# Altium project Bahram_Project.PrjPcb
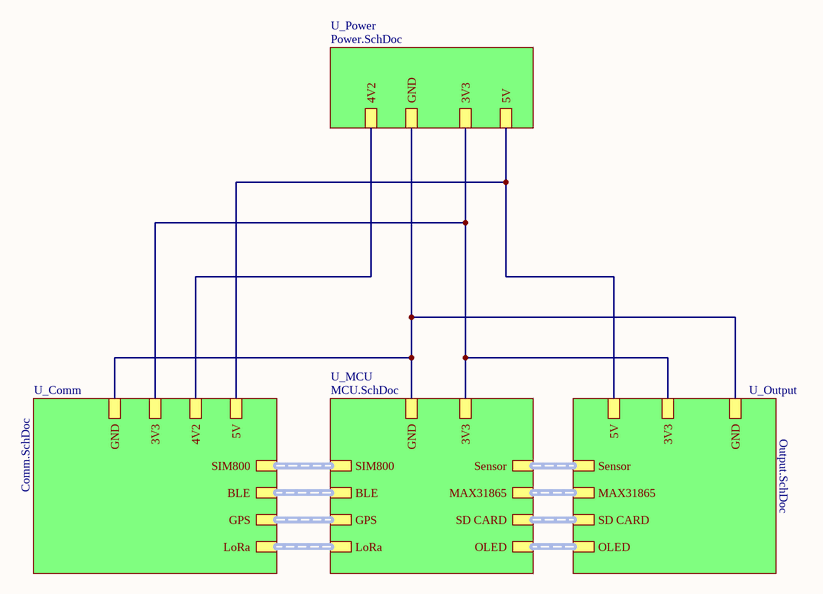
[diagram p0: main.SchDoc]
4 sheets, 72 parts. Net scope: strictly hierarchical (ports join the sheet entries above them; power ports are local).
Board file: Bahran_pcb.PcbDoc
Sheets:
  main.SchDoc
    U_Comm = Comm.SchDoc
    U_MCU = MCU.SchDoc
    U_Output = Output.SchDoc

## Sheet main.SchDoc
size A; SheetNumber: 1; SheetTotal: 5

### Sub-sheets
U_Comm = Comm.SchDoc: SIM800 (harness SIM800), BLE (harness BLE), GPS (harness GPS), LoRa (harness LORA), 5V, 4V2, 3V3, GND
U_MCU = MCU.SchDoc: SIM800 (harness SIM800), BLE (harness BLE), GPS (harness GPS), LoRa (harness LORA), Sensor (harness Sensor), MAX31865 (harness MAX31865), SD CARD (harness SD CARD), OLED (harness OLED), 3V3, GND
U_Output = Output.SchDoc: Sensor (harness Sensor), MAX31865 (harness MAX31865), SD CARD (harness SD CARD), OLED (harness OLED), 5V, 3V3, GND
U_Power = Power.SchDoc (file not in this document): 5V, 4V2, 3V3, GND

### Nets
3V3: sheet U_Comm/3V3, sheet U_MCU/3V3, sheet U_Output/3V3, sheet U_Power/3V3
4V2: sheet U_Comm/4V2, sheet U_Power/4V2
5_SW: sheet U_Comm/5V, sheet U_Output/5V, sheet U_Power/5V
GND: sheet U_Comm/GND, sheet U_MCU/GND, sheet U_Output/GND, sheet U_Power/GND

### Buses and harness runs
harness sheet U_Comm/BLE = sheet U_MCU/BLE
harness sheet U_Comm/GPS = sheet U_MCU/GPS
harness sheet U_Comm/LoRa = sheet U_MCU/LoRa
harness sheet U_Comm/SIM800 = sheet U_MCU/SIM800
harness sheet U_MCU/MAX31865 = sheet U_Output/MAX31865
harness sheet U_MCU/OLED = sheet U_Output/OLED
harness sheet U_MCU/SD CARD = sheet U_Output/SD CARD
harness sheet U_MCU/Sensor = sheet U_Output/Sensor

## Sheet Comm.SchDoc
size Legal; SheetNumber: 5; SheetTotal: 5
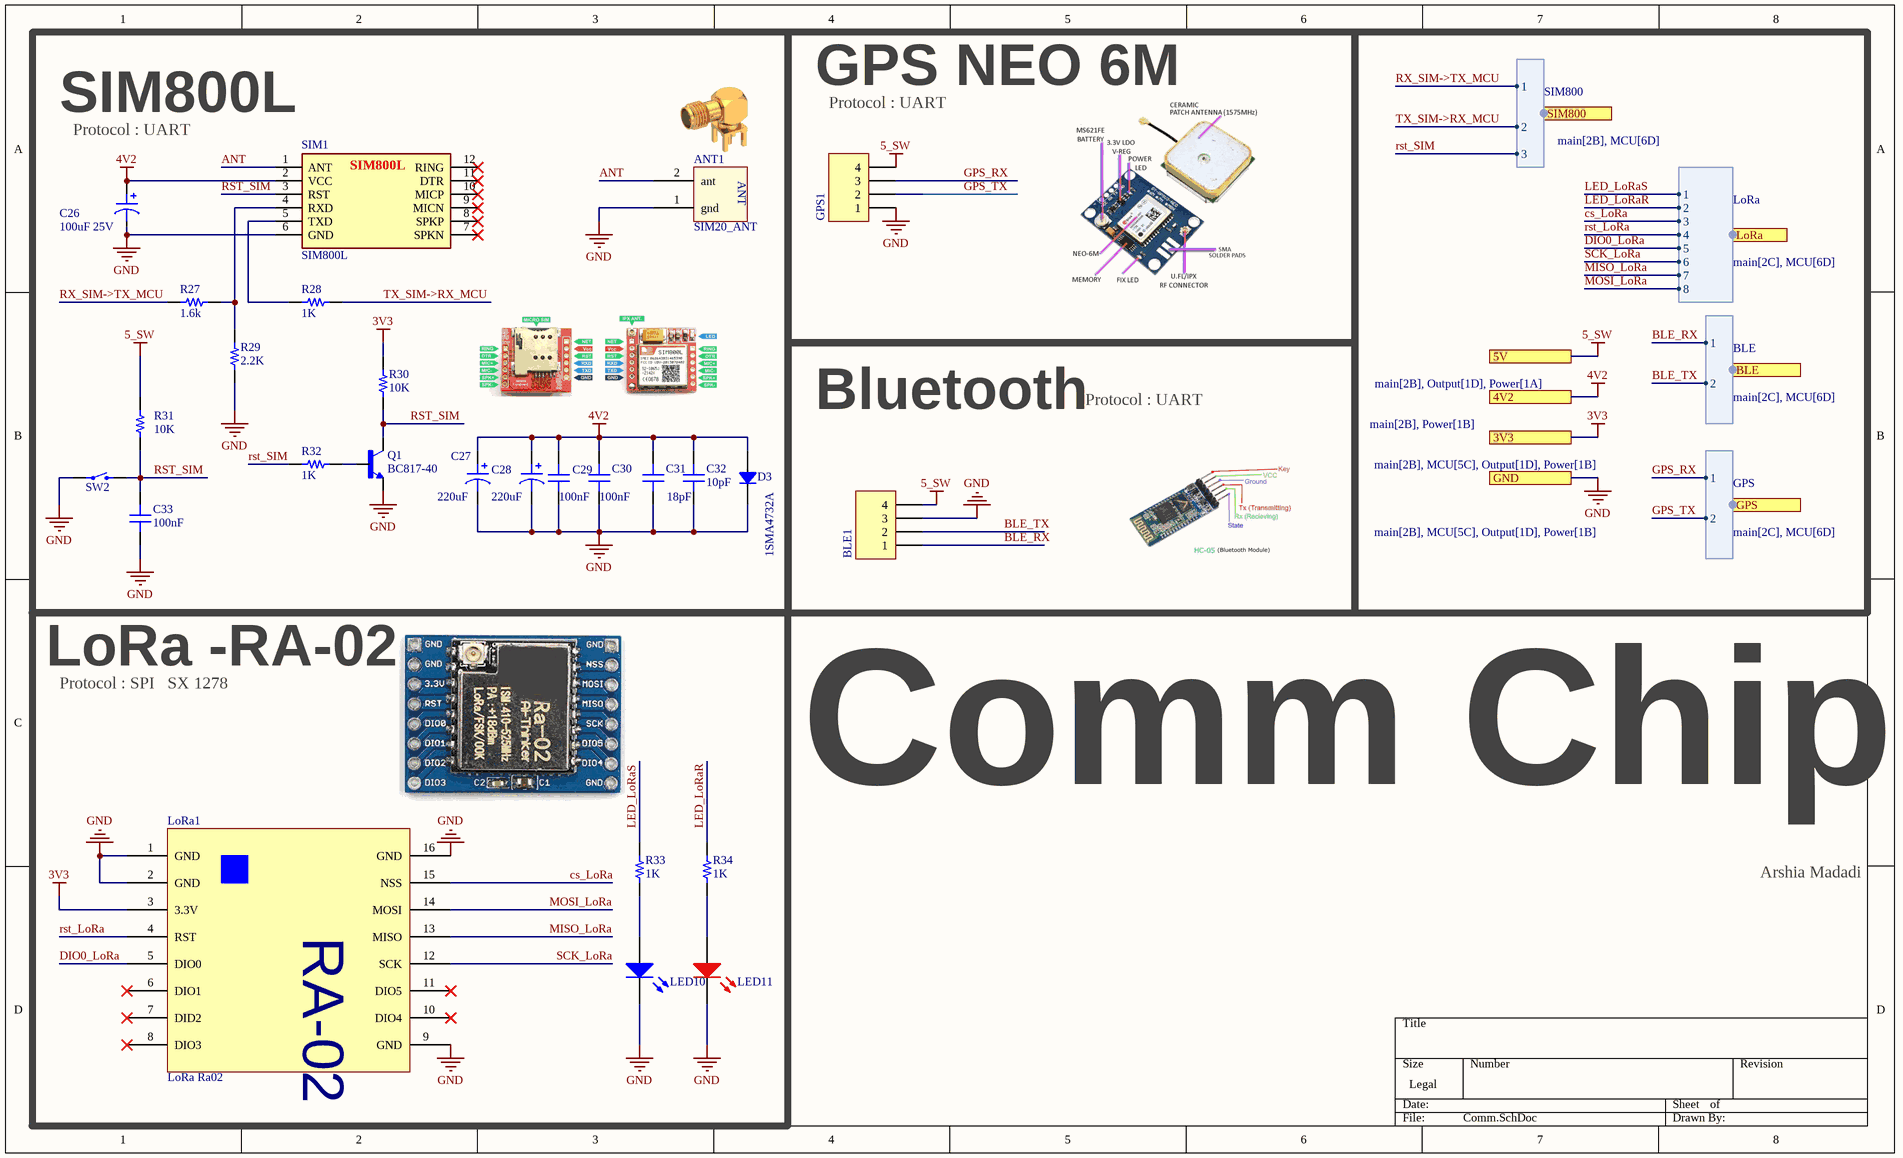
[diagram p1: Comm.SchDoc]

### Parts
ANT1  SIM20_ANT  [MY_SIM20_ANT]
BLE1  Header 4  [My_1X04]  (value not drawn)
C26  100uF 25V  [CAP ALSMD POLY 10.3MM H10.5MM]
C27  220uF  [CAP TANSMD 2312_6032 CASE C]
C28  220uF  [CAP TANSMD 2312_6032 CASE C]
C29  100nF  [CAP 0603_1608]
C30  100nF  [CAP 0603_1608]
C31  18pF  [CAP 0603_1608]
C32  10pF  [CAP 0603_1608]
C33  100nF  [CAP 0603_1608]
D3  1SMA4732A  [DO-214AC SMA]
GPS1  Header 4  [My_1X04]  (value not drawn)
LED10  LED SMD 0805 BLUE  [LED_0805_RED]  (value not drawn)
LED11  LED SMD 0805 RED  [LED_0805_RED]  (value not drawn)
LoRa1  LoRa Ra02  [LoRa - Ra-02]
Q1  BC817-40  [SOT95P237X112-3N]
R27  1.6k  [RES 0603_1608]
R28  1K  [RES 0603_1608]
R29  2.2K  [RES 0603_1608]
R30  10K  [RES 0603_1608]
R31  10K  [RES 0603_1608]
R32  1K  [RES 0603_1608]
R33  1K  [RES 0603_1608]
R34  1K  [RES 0603_1608]
SIM1  SIM800L  [SIM800L]
SW2  Tactile 2PIN 6X3.5mm H4.57mm (SMD)  [SWPBS_SPST_6X3X5]  (value not drawn)

### Blocks framed on the sheet
SIM800L: ANT1 C26-C33 D3 Q1 R27-R32 SIM1 SW2
GPS NEO 6M: GPS1
Bluetooth: BLE1
LoRa -RA-02: LED10 LED11 LoRa1 R33 R34

### Ports
3V3 (see main[2B], MCU[5C], Output[1D], Power[1B]), 4V2 (see main[2B], Power[1B]), 5V (see main[2B], Output[1D], Power[1A]), BLE (harness BLE, see main[2C], MCU[6D]), GND (see main[2B], MCU[5C], Output[1D], Power[1B]), GPS (harness GPS, see main[2C], MCU[6D]), LoRa (harness LORA, see main[2C], MCU[6D]), SIM800 (harness SIM800, see main[2B], MCU[6D])

### Harnesses
LoRa: 1, 2, 3, 4, 5, 6, 7, 8
BLE: 1, 2
GPS: 1, 2
SIM800: 1, 2, 3

### Nets
3V3: LoRa1.3(3.3V) R30.1 ; port 3V3
4V2: C26.1 C27.1 C28.1 C29.2 C30.2 C31.2 C32.2 D3.1 SIM1.2(VCC) ; port 4V2
5_SW: BLE1.4 GPS1.4 R31.2 ; port 5V
GND: ANT1.1(gnd) BLE1.3 C26.2 C27.2 C28.2 C29.1 C30.1 C31.1 C32.1 C33.1 D3.2 GPS1.1 LED10.2(K) LED11.2(K) LoRa1.1(GND) LoRa1.2(GND) LoRa1.9(GND) LoRa1.16(GND) Q1.2(E) R29.2 SIM1.6(GND) SW2.1 ; port GND
ANT: ANT1.2(ant) SIM1.1(ANT)
BLE_RX: BLE1.1 ; port BLE.1
BLE_TX: BLE1.2 ; port BLE.2
cs_LoRa: LoRa1.15(NSS) ; port LoRa.3
DIO0_LoRa: LoRa1.5(DIO0) ; port LoRa.5
GPS_RX: GPS1.3 ; port GPS.1
GPS_TX: GPS1.2 ; port GPS.2
LED_LoRaR: R34.1 ; port LoRa.2
LED_LoRaS: R33.1 ; port LoRa.1
MISO_LoRa: LoRa1.13(MISO) ; port LoRa.7
MOSI_LoRa: LoRa1.14(MOSI) ; port LoRa.8
rst_LoRa: LoRa1.4(RST) ; port LoRa.4
RST_SIM: C33.2 Q1.3(C) R30.2 R31.1 R32.2 SIM1.3(RST) SW2.2 ; port SIM800.3
RX_SIM->TX_MCU: R27.1 ; port SIM800.1
SCK_LoRa: LoRa1.12(SCK) ; port LoRa.6
TX_SIM->RX_MCU: R28.1 ; port SIM800.2
NetLED10_1: LED10.1(A) R33.2
NetLED11_1: LED11.1(A) R34.2
NetQ1_1: Q1.1(B) R32.1
NetR27_2: R27.2 R29.1 SIM1.4(RXD)
NetR28_2: R28.2 SIM1.5(TXD)

Not connected (* = marked no-connect by the designer): LoRa1 6(DIO1)* 7(DID2)* 8(DIO3)* 10(DIO4)* 11(DIO5)*; SIM1 7(SPKN)* 8(SPKP)* 9(MICN)* 10(MICP)* 11(DTR)* 12(RING)*

### Notes on the sheet
- Protocol : UART
- Protocol : SPI
- SX 1278
- Comm Chip
- Arshia Madadi
- (in symbol LoRa) RA-02

### Library data of the parts
ANT1 = SIM20_ANT: ANT
BLE1 GPS1 = Header 4: Header, 4-Pin; LatestRevisionDate: 17-Jul-2002; LatestRevisionNote: Re-released for DXP Platform.; Publisher: Altium Limited
C26 = Cap Alu SMD 10.3mm H10.5mm: SMT Aluminum Polymer Capacitor; VALUE: 10uF 6.3V
C27 C28 = Cap Tan Case C: SMT Tantalum Capacitor; VALUE: 10uF 6.3V
C29 C30 C33 = Cap 0603: SMT Capacitor; VALUE: 100nF
C31 C32 = Cap 0603: SMT Capacitor; VALUE: 100nF
D3 = US1M (SMD SMA): Diode Standard 1000V 1A Surface Mount SMA; PartNumber: US1M-13-F
LoRa1 = LoRa
Q1 = BC817-40_RFG: SOT-23, 50V, 0.5A, NPN Bipolar Transistor; MP: BC817-40 RFG; MF: Taiwan Semiconductor; Check_prices: https://www.snapeda.com/parts/BC817-40%20RFG/Taiwan+Semiconductor/view-part/?ref=eda; Price: None; Purchase-URL: https://pricing.snapeda.com/search/part/BC817-40 RFG/?ref=eda; SnapEDA_Link: https://www.snapeda.com/parts/BC817-40%20RFG/Taiwan+Semiconductor/view-part/?ref=snap; Availability: In Stock; Package: SOT-23 Taiwan Semiconductor; Value: *; ComponentLink1Description: Buy; ComponentLink1URL: https://lionelectronic.ir/products/134-BC817-40
R27-R34 = Res 0603: SMT Resistor; VALUE: 100K
SW2 = Tactile 2PIN 6X3.5mm H4.57mm (SMD): Tactile Switch SPST-NO Top Actuated Surface Mount; PartNumber: FSMSMTR-ND
SIM1 = SIM800L: Publisher: 3DFootprint.ir

## Sheet MCU.SchDoc
size Tabloid; SheetNumber: 3; SheetTotal: 5
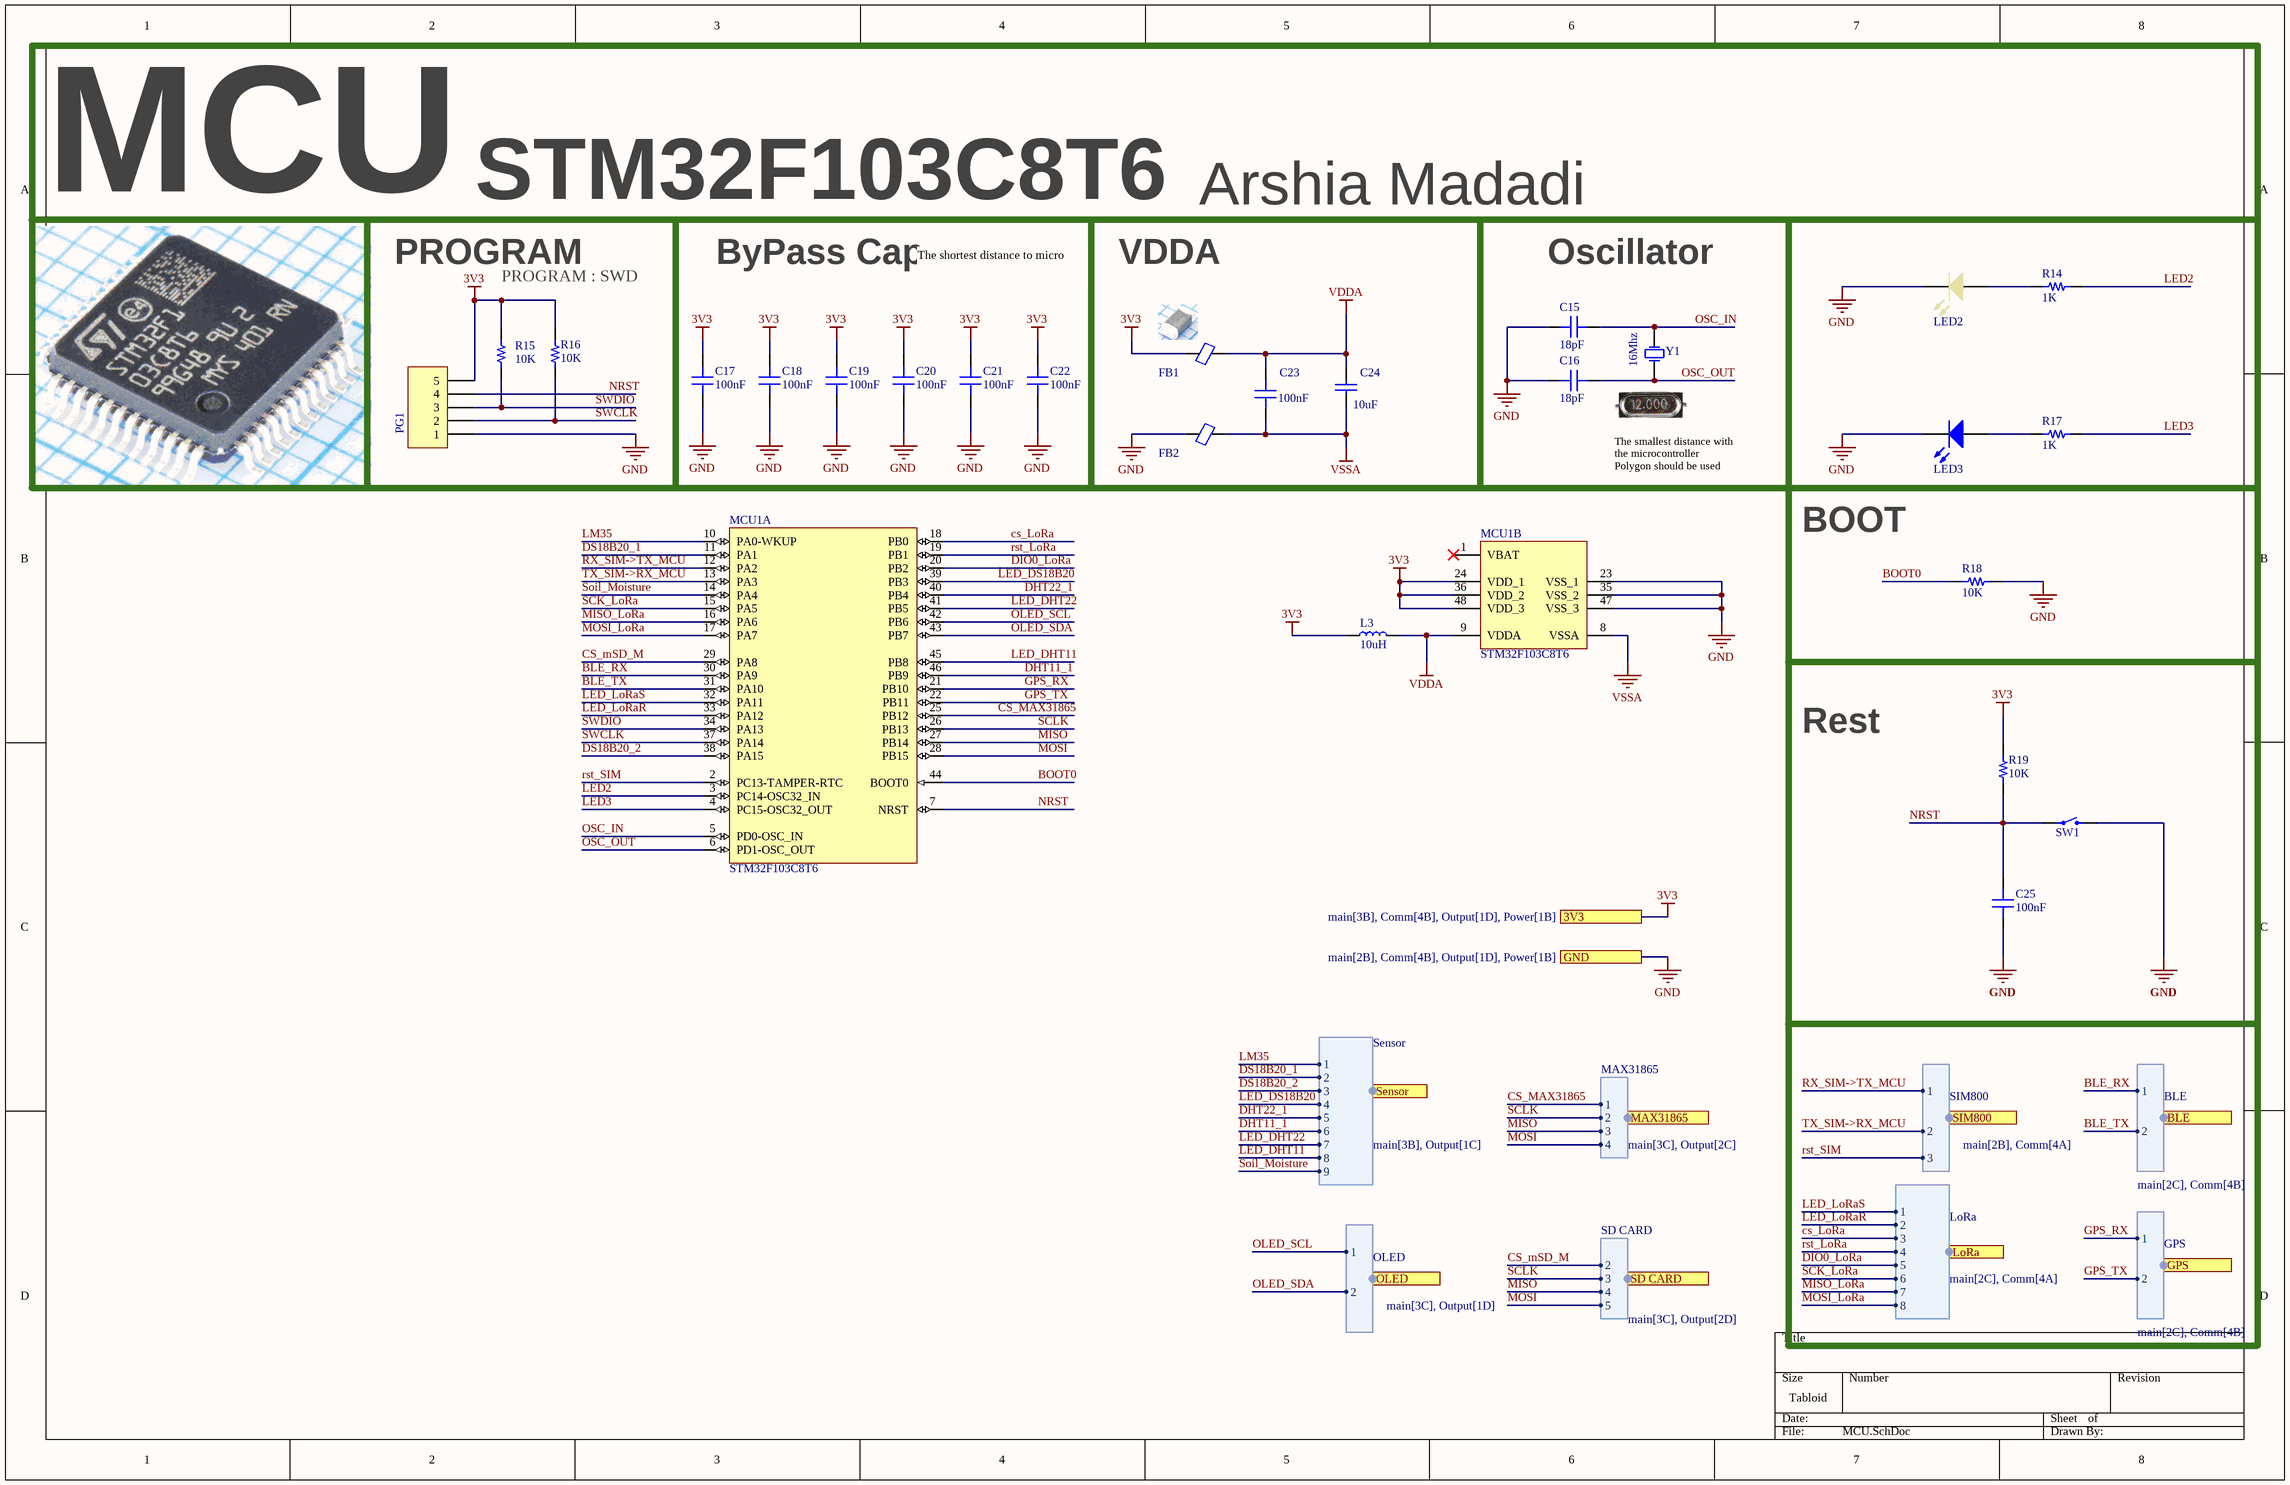
[diagram p2: MCU.SchDoc]

### Parts
C15  18pF  [CAP 0603_1608]
C16  18pF  [CAP 0603_1608]
C17  100nF  [CAP 0603_1608]
C18  100nF  [CAP 0603_1608]
C19  100nF  [CAP 0603_1608]
C20  100nF  [CAP 0603_1608]
C21  100nF  [CAP 0603_1608]
C22  100nF  [CAP 0603_1608]
C23  100nF  [CAP 0603_1608]
C24  10uF  [MY_CAP_SMD_0603]
C25  100nF  [CAP 0603_1608]
FB1  Ferrite Bead SMD  [FB1206]  (value not drawn)
FB2  Ferrite Bead SMD  [FB1206]  (value not drawn)
L3  10uH  [IND 1206_3216]
LED2  LED SMD 0805 WHITE  [LED_0805_WHITE]  (value not drawn)
LED3  LED SMD 0805 BLUE  [LED_0805_RED]  (value not drawn)
MCU1  STM32F103C8T6  [QFP50P900X900X160-48N]  (parts A,B of 2)
PG1  Header 5  [My_1X05]  (value not drawn)
R14  1K  [RES 0603_1608]
R15  10K  [RES 0603_1608]
R16  10K  [RES 0603_1608]
R17  1K  [RES 0603_1608]
R18  10K  [RES 0603_1608]
R19  10K  [RES 0603_1608]
SW1  Tactile 2PIN 6X3.5mm H4.57mm (SMD)  [SWPBS_SPST_6X3X5]  (value not drawn)
Y1  16Mhz  [Crystal]

### Blocks framed on the sheet
MCU: C15-C24 FB1 FB2 LED2 LED3 PG1 R14-R17 Y1
BOOT: R18
Rest: C25 R19 SW1

### Ports
3V3 (see main[3B], Comm[4B], Output[1D], Power[1B]), BLE (harness BLE, see main[2C], Comm[4B]), GND (see main[2B], Comm[4B], Output[1D], Power[1B]), GPS (harness GPS, see main[2C], Comm[4B]), LoRa (harness LORA, see main[2C], Comm[4A]), MAX31865 (harness MAX31865, see main[3C], Output[2C]), OLED (harness OLED, see main[3C], Output[1D]), SD CARD (harness SD CARD, see main[3C], Output[2D]), Sensor (harness Sensor, see main[3B], Output[1C]), SIM800 (harness SIM800, see main[2B], Comm[4A])

### Harnesses
SIM800: 1, 2, 3
LoRa: 1, 2, 3, 4, 5, 6, 7, 8
Sensor: 1, 2, 3, 4, 5, 6, 7, 8, 9
BLE: 1, 2
GPS: 1, 2
MAX31865: 1, 2, 3, 4
SD CARD: 2, 3, 4, 5
OLED: 1, 2

### Nets
3V3: C17.2 C18.2 C19.2 C20.2 C21.2 C22.2 FB1.1 L3.1 MCU1.24(VDD_1) MCU1.36(VDD_2) MCU1.48(VDD_3) PG1.5 R15.1 R16.1 R19.1 ; port 3V3
GND: C15.2 C16.2 C17.1 C18.1 C19.1 C20.1 C21.1 C22.1 C25.1 FB2.1 LED2.2(K) LED3.2(K) MCU1.23(VSS_1) MCU1.35(VSS_2) MCU1.47(VSS_3) PG1.1 R18.1 SW1.2 ; port GND
VDDA: C23.2 C24.1 FB1.2 L3.2 MCU1.9(VDDA)
VSSA: C23.1 C24.2 FB2.2 MCU1.8(VSSA)
BLE_RX: MCU1.30(PA9) ; port BLE.1
BLE_TX: MCU1.31(PA10) ; port BLE.2
BOOT0: MCU1.44(BOOT0) R18.2
cs_LoRa: MCU1.18(PB0) ; port LoRa.3
CS_MAX31865: MCU1.25(PB12) ; port MAX31865.1
CS_mSD_M: MCU1.29(PA8) ; port SD CARD.2
DHT11_1: MCU1.46(PB9) ; port Sensor.6
DHT22_1: MCU1.40(PB4) ; port Sensor.5
DIO0_LoRa: MCU1.20(PB2) ; port LoRa.5
DS18B20_1: MCU1.11(PA1) ; port Sensor.2
DS18B20_2: MCU1.38(PA15) ; port Sensor.3
GPS_RX: MCU1.21(PB10) ; port GPS.1
GPS_TX: MCU1.22(PB11) ; port GPS.2
LED2: MCU1.3(PC14-OSC32_IN) R14.1
LED3: MCU1.4(PC15-OSC32_OUT) R17.1
LED_DHT11: MCU1.45(PB8) ; port Sensor.8
LED_DHT22: MCU1.41(PB5) ; port Sensor.7
LED_DS18B20: MCU1.39(PB3) ; port Sensor.4
LED_LoRaR: MCU1.33(PA12) ; port LoRa.2
LED_LoRaS: MCU1.32(PA11) ; port LoRa.1
LM35: MCU1.10(PA0-WKUP) ; port Sensor.1
MISO: MCU1.27(PB14) ; port MAX31865.3, port SD CARD.4
MISO_LoRa: MCU1.16(PA6) ; port LoRa.7
MOSI: MCU1.28(PB15) ; port MAX31865.4, port SD CARD.5
MOSI_LoRa: MCU1.17(PA7) ; port LoRa.8
NRST: C25.2 MCU1.7(NRST) PG1.4 R19.2 SW1.1
OLED_SCL: MCU1.42(PB6) ; port OLED.1
OLED_SDA: MCU1.43(PB7) ; port OLED.2
OSC_IN: C15.1 MCU1.5(PD0-OSC_IN) Y1.2(OSC2)
OSC_OUT: C16.1 MCU1.6(PD1-OSC_OUT) Y1.1(OSC1)
rst_LoRa: MCU1.19(PB1) ; port LoRa.4
RST_SIM: MCU1.2(PC13-TAMPER-RTC) ; port SIM800.3
RX_SIM->TX_MCU: MCU1.12(PA2) ; port SIM800.1
SCK_LoRa: MCU1.15(PA5) ; port LoRa.6
SCLK: MCU1.26(PB13) ; port MAX31865.2, port SD CARD.3
Soil_Moisture: MCU1.14(PA4) ; port Sensor.9
SWCLK: MCU1.37(PA14) PG1.2 R16.2
SWDIO: MCU1.34(PA13) PG1.3 R15.2
TX_SIM->RX_MCU: MCU1.13(PA3) ; port SIM800.2
NetLED2_1: LED2.1(A) R14.2
NetLED3_1: LED3.1(A) R17.2

Not connected (* = marked no-connect by the designer): MCU1 1(VBAT)*

### Notes on the sheet
- STM32F103C8T6
- Arshia Madadi
- PROGRAM
- PROGRAM : SWD
- ByPass Cap
- The shortest distance to micro
- VDDA
- Oscillator
- The smallest distance with the microcontroller
  Polygon should be used

### Library data of the parts
C15-C23 C25 = Cap 0603: SMT Capacitor
  C15 C16: VALUE: 18pF
  C17-C23 C25: VALUE: 100nF
C24 = CAP SMD_0603: 1.6 mm × 0.8 mm
FB1 FB2 = Ferrite Bead SMD Package: Designer: Ali Hafizi
L3 = Ind 1206: SMT Inductor; Value: 10uH
MCU1 = STM32F103C8T6: ARM Cortex-M3 32-bit MCU, 64 KB Flash, 20 KB Internal RAM, 37 I/Os, 48-pin LQFP, -40 to 85 degC, Tray; A/D Converter: 2x12-bit (10 Channel); FLASH Size (Prog) (kB): 64; I/Os (High Current): 37; Internal RAM Size (kB): 20; Operating Frequency(F) (Processor speed) (MHz): 72; Supply Voltage(Vcc) min (V): 2; DatasheetVersion: Rev. 16; PackageVersion: Rev. 6, 06/2013; PackageReference: LQFP48; PackageDescription: 48-Pin Low Profile Quad Flat Package, 7 x 7 mm Body, 0.5 mm Pitch; Supplier 1: Digi-Key; Supplier Part Number 1: 497-6063-ND; Supplier 2: Farnell; Supplier Part Number 2: 1447637; Supplier 3: Newark; Supplier Part Number 3: 59M2182; Supplier 4: Newark; Supplier Part Number 4: 57P1222; Supplier 5: Mouser; Supplier Part Number 5: 511-STM32F103C8T6; Core: ARM Cortex-M3; Packing: Tray; Mounting Technology: Surface Mount; PartNumber: STM32F103C8T6; ComponentLink1Description: Manufacturer URL; ComponentLink1URL: http://www.st.com/web/en/home.html; ComponentLink2Description: Datasheet; ComponentLink2URL: http://www.st.com/st-web-ui/static/active/en/resource/technical/document/datasheet/CD00161566.pdf; ComponentLink3Description: Package Specification; ComponentLink3URL: http://www.st.com/st-web-ui/static/active/en/resource/technical/document/datasheet/DM00058181.pdf
PG1 = Header 5: Header, 5-Pin; LatestRevisionDate: 17-Jul-2002; LatestRevisionNote: Re-released for DXP Platform.; Publisher: Altium Limited
R14 R17 = Res 0603: SMT Resistor; VALUE: 10K
R15 R16 R18 R19 = Res 0603: SMT Resistor; VALUE: 10K
SW1 = Tactile 2PIN 6X3.5mm H4.57mm (SMD): as SW2 on sheet Comm
Y1 = XTAL: Crystal Oscillator; Published: 8-Jun-2000; LatestRevisionDate: 17-Jul-2002; LatestRevisionNote: Re-released for DXP Platform.; PackageReference: R38; Publisher: Altium Limited

## Sheet Output.SchDoc
size Tabloid; SheetNumber: 4; SheetTotal: 5
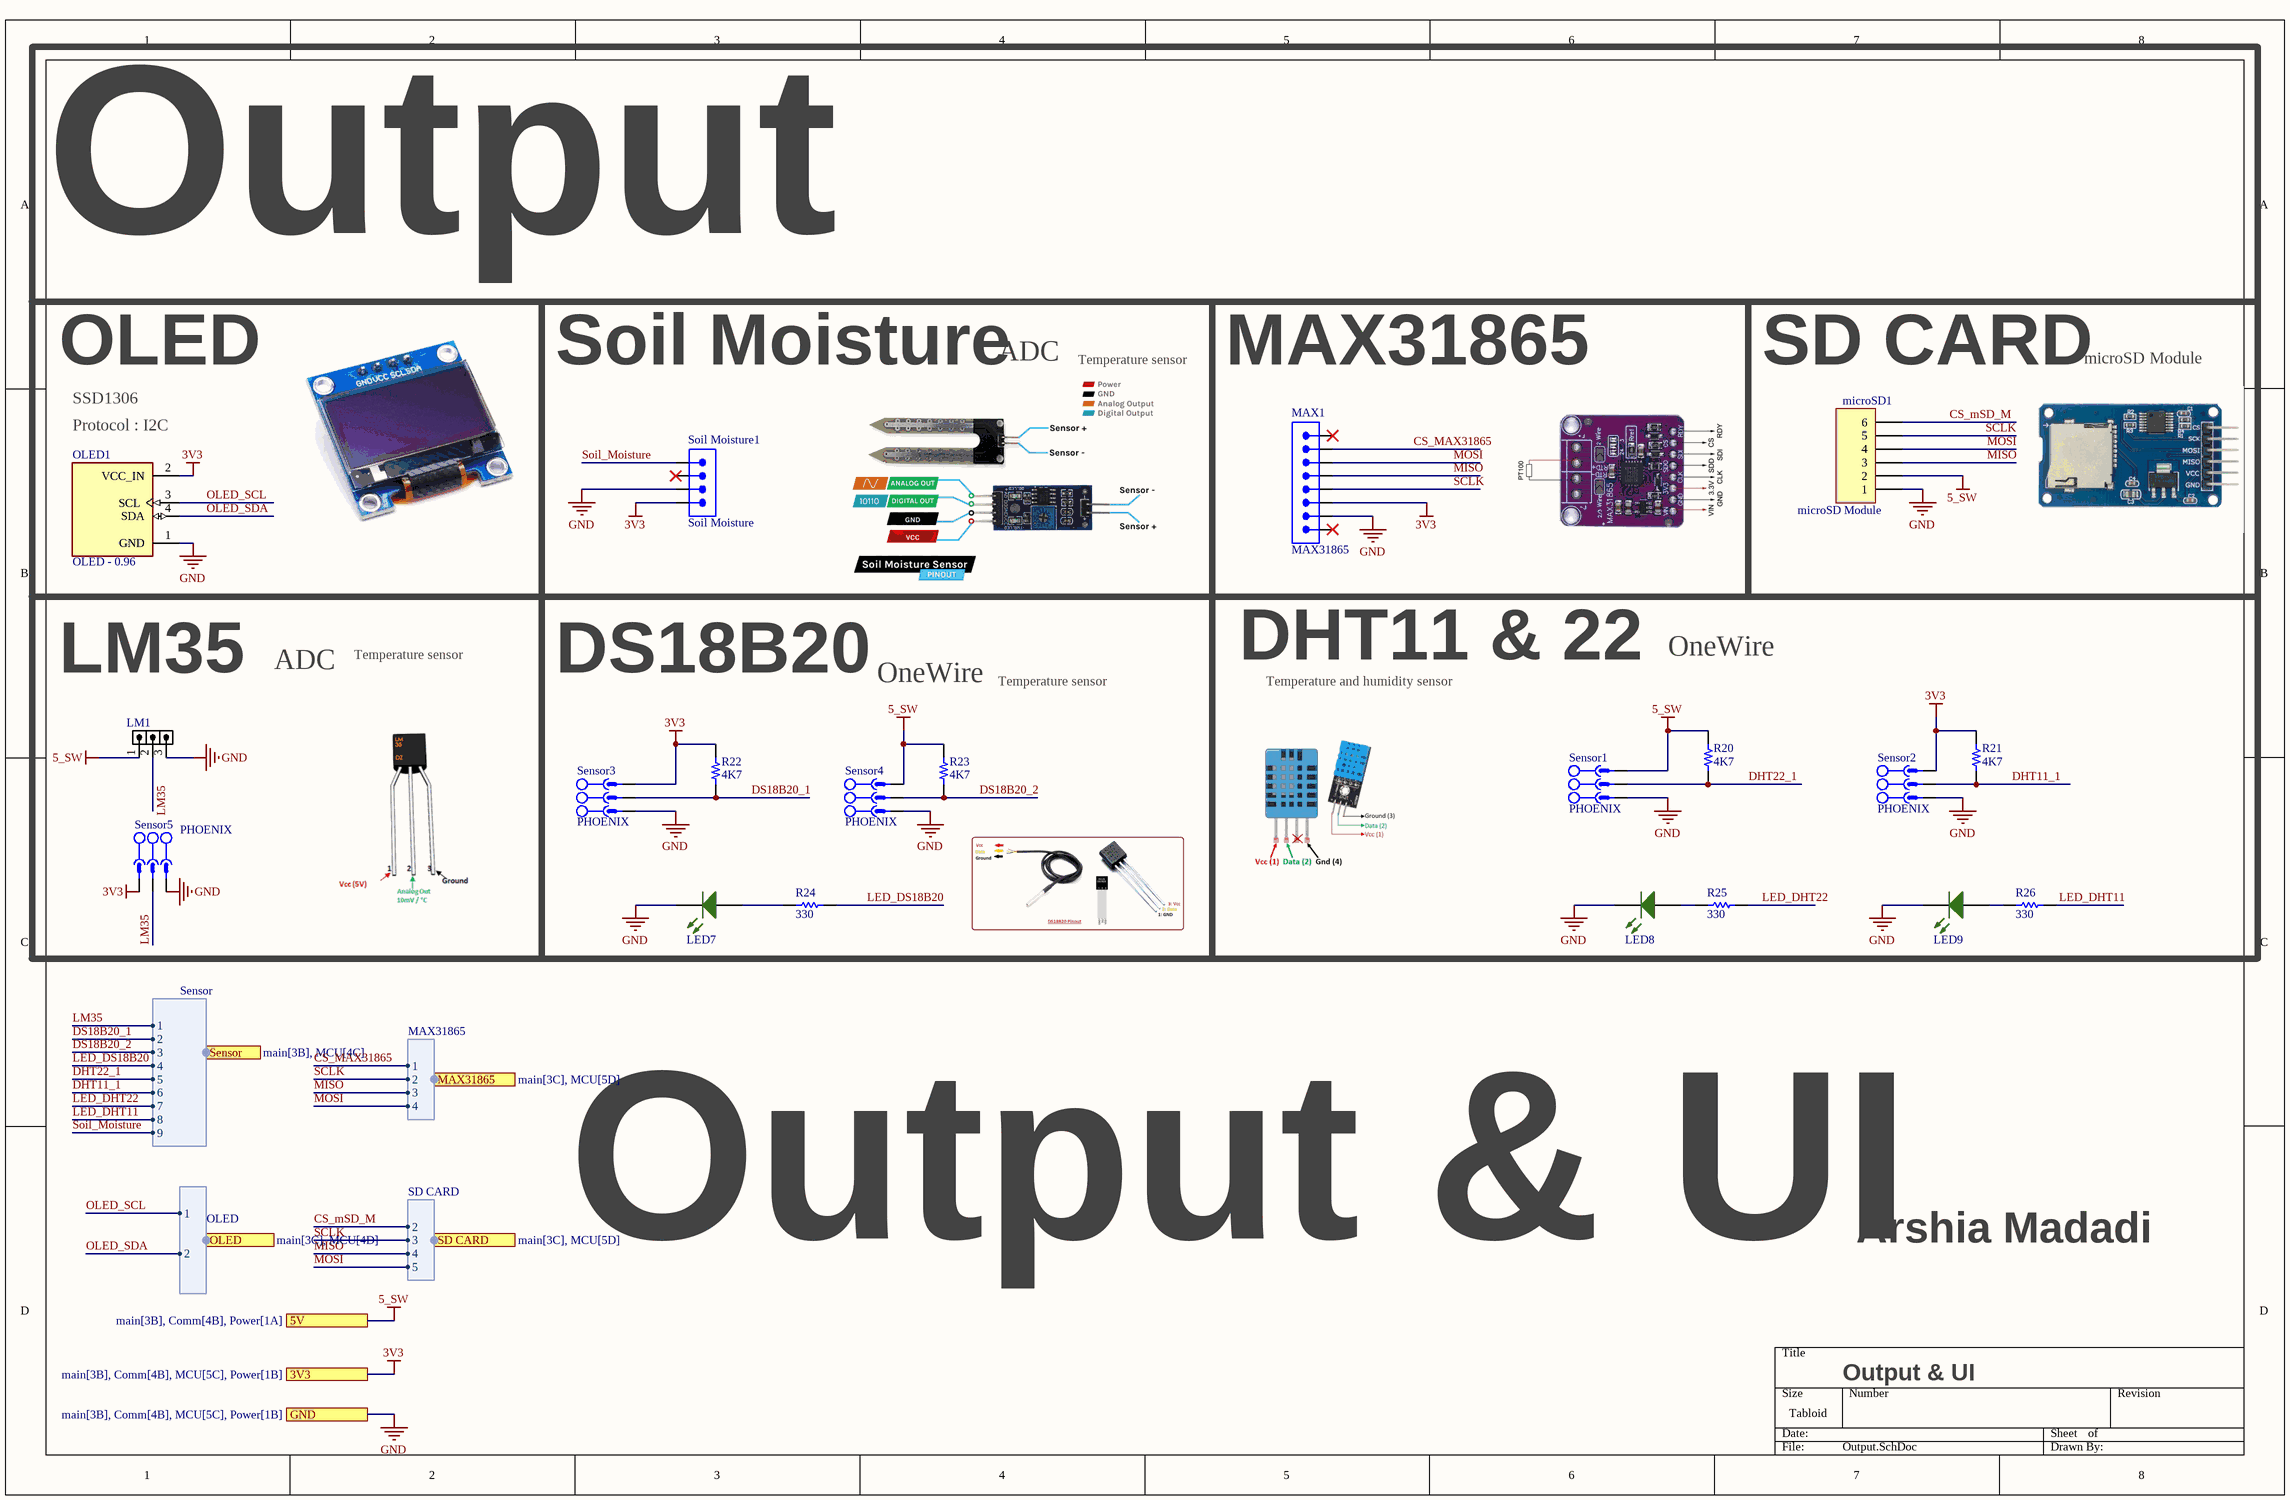
[diagram p3: Output.SchDoc]

### Parts
LED7  LED SMD 0805 GREEN  [LED_0805_GREEN]  (value not drawn)
LED8  LED SMD 0805 GREEN  [LED_0805_GREEN]  (value not drawn)
LED9  LED SMD 0805 GREEN  [LED_0805_GREEN]  (value not drawn)
LM1  HDRM3  [HDR_1X3]  (value not drawn)
MAX1  MAX31865  [MHDR1X08-254P]
microSD1  microSD Module  [HDR1X6-1]
OLED1  OLED - 0.96  [MODULE_DM-OLED096-636]
R20  4K7  [RES 0603_1608]
R21  4K7  [RES 0603_1608]
R22  4K7  [RES 0603_1608]
R23  4K7  [RES 0603_1608]
R24  330  [RESC3413X04N]
R25  330  [RESC3413X04N]
R26  330  [RESC3413X04N]
Sensor1  PHOENIX  [MSTB 2,5/3-G-5,08]
Sensor2  PHOENIX  [MSTB 2,5/3-G-5,08]
Sensor3  PHOENIX  [MSTB 2,5/3-G-5,08]
Sensor4  PHOENIX  [MSTB 2,5/3-G-5,08]
Sensor5  PHOENIX  [MSTB 2,5/3-G-5,08]
Soil_Moisture1  Soil Moisture  [MHDR1X04-254P]

### Blocks framed on the sheet
Output: OLED1
Soil Moisture: Soil_Moisture1
MAX31865: MAX1
LM35: LM1 Sensor5
DS18B20: LED7 R22-R24 Sensor3 Sensor4
DHT11 & 22: LED8 LED9 R20 R21 R25 R26 Sensor1 Sensor2

### Ports
3V3 (see main[3B], Comm[4B], MCU[5C], Power[1B]), 5V (see main[3B], Comm[4B], Power[1A]), GND (see main[3B], Comm[4B], MCU[5C], Power[1B]), MAX31865 (harness MAX31865, see main[3C], MCU[5D]), OLED (harness OLED, see main[3C], MCU[4D]), SD CARD (harness SD CARD, see main[3C], MCU[5D]), Sensor (harness Sensor, see main[3B], MCU[4C])

### Harnesses
Sensor: 1, 2, 3, 4, 5, 6, 7, 8, 9
MAX31865: 1, 2, 3, 4
SD CARD: 2, 3, 4, 5
OLED: 1, 2

### Nets
3V3: MAX1.6 OLED1.2(VCC_IN) R21.2 R22.2 Sensor2.1 Sensor3.1 Sensor5.3 Soil_Moisture1.4 ; port 3V3
5_SW: LM1.1 microSD1.2 R20.2 R23.2 Sensor1.1 Sensor4.1 ; port 5V
GND: LED7.2(K) LED8.1(A) LED9.2(K) LM1.3 MAX1.7 microSD1.1 OLED1.1(GND) Sensor1.3 Sensor2.3 Sensor3.3 Sensor4.3 Sensor5.1 Soil_Moisture1.3 ; port GND
CS_MAX31865: MAX1.2 ; port MAX31865.1
CS_mSD_M: microSD1.6 ; port SD CARD.2
DHT11_1: R21.1 Sensor2.2 ; port Sensor.6
DHT22_1: R20.1 Sensor1.2 ; port Sensor.5
DS18B20_1: R22.1 Sensor3.2 ; port Sensor.2
DS18B20_2: R23.1 Sensor4.2 ; port Sensor.3
LED_DHT11: R26.1 ; port Sensor.8
LED_DHT22: R25.1 ; port Sensor.7
LED_DS18B20: R24.1 ; port Sensor.4
LM35: LM1.2 Sensor5.2 ; port Sensor.1
MISO: MAX1.4 microSD1.3 ; port MAX31865.3, port SD CARD.4
MOSI: MAX1.3 microSD1.4 ; port MAX31865.4, port SD CARD.5
OLED_SCL: OLED1.3(SCL) ; port OLED.1
OLED_SDA: OLED1.4(SDA) ; port OLED.2
SCLK: MAX1.5 microSD1.5 ; port MAX31865.2, port SD CARD.3
Soil_Moisture: Soil_Moisture1.1 ; port Sensor.9
NetLED7_1: LED7.1(A) R24.2
NetLED8_2: LED8.2(K) R25.2
NetLED9_1: LED9.1(A) R26.2

Not connected (* = marked no-connect by the designer): MAX1 1* 8*; Soil_Moisture1 2*

### Notes on the sheet
- OLED
- ADC
- Temperature sensor
- (near microSD1) SD CARD
- microSD Module
- SSD1306
- (near OLED1) Protocol : I2C
- OneWire
- Temperature and humidity sensor
- Arshia Madadi
- Output & UI

### Library data of the parts
LM1 = HDR_1X3: CONN, HEADER, Male, pitch: 2.54mm, 3POS; VALUE: HDRM3
MAX1 = MHDR_1X08: Male Header 1X08
microSD1 = Header 6: Header, 6-Pin; LatestRevisionDate: 17-Jul-2002; LatestRevisionNote: Re-released for DXP Platform.; Publisher: Altium Limited
OLED1 = DM-OLED096-636: 0.96â€ 128 X 64 MONOCHROME GRAPHIC OLED DISPLAY MODULE - I2C; SnapEDA_Link: https://www.snapeda.com/parts/DM-OLED096-636/Display+Module/view-part/?ref=snap; Package: Package; Value: *; MF: Display Module; MP: DM-OLED096-636; Check_prices: https://www.snapeda.com/parts/DM-OLED096-636/Display+Module/view-part/?ref=eda
R20-R23 = Res 0603: VALUE: 1K
R24-R26 = RES 0805 0.125W: RES 0805; Designer: Abbas Basereh; Desc.: RES SMD 0805; Data: 16-12-2016
Sensor1-Sensor5 = CON_Phoenix_MSTB_03: 3 Pitch: 5.08 mm Color: green Contact surface: Tin Assembly; Manufacturer: PHOENIX CONTACT; Connector type: PCB Terminal Block; designer: ABBAS BASEREH; Max Current: 12 A; Positions: 3; Voltage: 320 V; Category: Connector; ComponentLink1Description: Header, Nominal current: 12 A Rated voltage (III/2): 320 V Number of positions: 3 Pitch: 5.08 mm Color: green Contact surface: Tin Assembly: Soldering  DESIGNER:ABBAS BASEREH; ComponentLink2Description: Reference; Mounting Technology: Through-Hole; Pin Count: 3; Revision 1: 2017-3-1; Status: Unreleased; PART.NO: PHOENIX
Soil_Moisture1 = MHDR_1X04: Male Header 1X04

## Nets that join several sheets
3V3: Comm (LoRa1.3 R30.1), MCU (15 pins), Output (8 pins)
5_SW: Comm (BLE1.4 GPS1.4 R31.2), Output (6 pins)
GND: Comm (22 pins), MCU (18 pins), Output (13 pins)
BLE_RX: Comm (BLE1.1), MCU (MCU1.30)
BLE_TX: Comm (BLE1.2), MCU (MCU1.31)
cs_LoRa: Comm (LoRa1.15), MCU (MCU1.18)
CS_MAX31865: MCU (MCU1.25), Output (MAX1.2)
CS_mSD_M: MCU (MCU1.29), Output (microSD1.6)
DHT11_1: MCU (MCU1.46), Output (R21.1 Sensor2.2)
DHT22_1: MCU (MCU1.40), Output (R20.1 Sensor1.2)
DIO0_LoRa: Comm (LoRa1.5), MCU (MCU1.20)
DS18B20_1: MCU (MCU1.11), Output (R22.1 Sensor3.2)
DS18B20_2: MCU (MCU1.38), Output (R23.1 Sensor4.2)
GPS_RX: Comm (GPS1.3), MCU (MCU1.21)
GPS_TX: Comm (GPS1.2), MCU (MCU1.22)
LED_DHT11: MCU (MCU1.45), Output (R26.1)
LED_DHT22: MCU (MCU1.41), Output (R25.1)
LED_DS18B20: MCU (MCU1.39), Output (R24.1)
LED_LoRaR: Comm (R34.1), MCU (MCU1.33)
LED_LoRaS: Comm (R33.1), MCU (MCU1.32)
LM35: MCU (MCU1.10), Output (LM1.2 Sensor5.2)
MISO: MCU (MCU1.27), Output (MAX1.4 microSD1.3)
MISO_LoRa: Comm (LoRa1.13), MCU (MCU1.16)
MOSI: MCU (MCU1.28), Output (MAX1.3 microSD1.4)
MOSI_LoRa: Comm (LoRa1.14), MCU (MCU1.17)
OLED_SCL: MCU (MCU1.42), Output (OLED1.3)
OLED_SDA: MCU (MCU1.43), Output (OLED1.4)
rst_LoRa: Comm (LoRa1.4), MCU (MCU1.19)
RST_SIM: Comm (7 pins), MCU (MCU1.2)
RX_SIM->TX_MCU: Comm (R27.1), MCU (MCU1.12)
SCK_LoRa: Comm (LoRa1.12), MCU (MCU1.15)
SCLK: MCU (MCU1.26), Output (MAX1.5 microSD1.5)
Soil_Moisture: MCU (MCU1.14), Output (Soil_Moisture1.1)
TX_SIM->RX_MCU: Comm (R28.1), MCU (MCU1.13)